# Altium project ESC_Board_Prj.PrjPcb (part 2 of 2)

## Sheet Non_Iso_Regulators.SchDoc
size A4; SheetNumber: 4; SheetTotal: 4
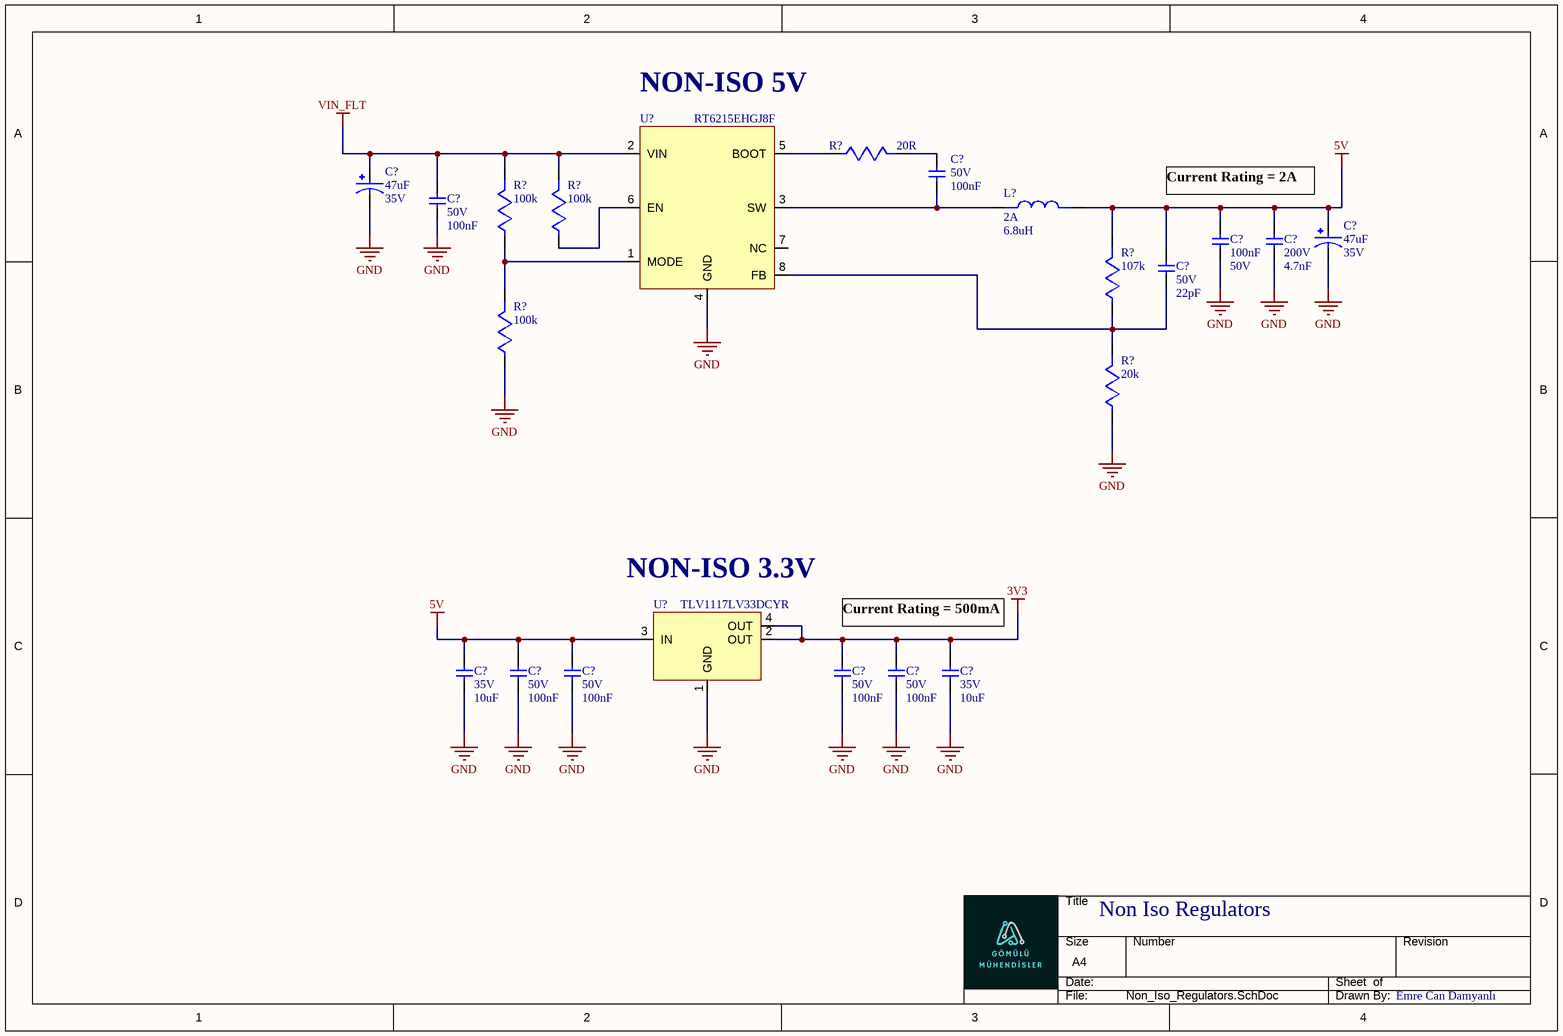
[diagram p3: Non_Iso_Regulators.SchDoc]

### Parts
(Parts that share a designator on the sheet are numbered #1, #2 ... from top to bottom, then left to right.)
C?#19  value 100nF  Voltage Rating: 50V  [CAPC1608X94N]  (hidden comment: C0603C104K5RACTU)
C?#20  value 47uF  Voltage Ratings: 35V  [CAPMP7343X310N]  (hidden comment: T495X476M035ATE300)
C?#21  value 100nF  Voltage Rating: 50V  [CAPC1608X94N]  (hidden comment: C0603C104K5RACTU)
C?#22  value 100nF  Voltage: 50V  [CAPC3216X160N]  (hidden comment: KAM31NR81H104KU)
C?#23  value 4.7nF  Voltage Rating: 200V  (hidden comment: C1206C472J2GECAUTO)
C?#24  value 47uF  Voltage Ratings: 35V  [CAPMP7343X310N]  (hidden comment: T495X476M035ATE300)
C?#25  value 22pF  Voltage Rating (DC): 50V  [CAPC1608X94N]  (hidden comment: C0603C220J5GACTU)
C?#26  value 10uF  Voltage Rating: 35V  [CAPC2012X145N]  (hidden comment: C2012X5R1V106K125AC)
C?#27  value 100nF  Voltage Rating: 50V  [CAPC1608X94N]  (hidden comment: C0603C104K5RACTU)
C?#28  value 100nF  Voltage Rating: 50V  [CAPC1608X94N]  (hidden comment: C0603C104K5RACTU)
C?#29  value 100nF  Voltage Rating: 50V  [CAPC1608X94N]  (hidden comment: C0603C104K5RACTU)
C?#30  value 100nF  Voltage Rating: 50V  [CAPC1608X94N]  (hidden comment: C0603C104K5RACTU)
C?#31  value 10uF  Voltage Rating: 35V  [CAPC2012X145N]  (hidden comment: C2012X5R1V106K125AC)
L?  value 6.8uH  Current Rating: 2A  [INDPM5752X200N]  (hidden comment: 74437334068)
R?#13  value 20R  (hidden comment: RC0603FR-0720RL)
R?#14  value 100k  [RESISTOR_0603]  (hidden comment: RC0603FR-07100KL)
R?#15  value 100k  [RESISTOR_0603]  (hidden comment: RC0603FR-07100KL)
R?#16  value 107k  [RESISTOR_0603]  (hidden comment: RC0603FR-07107KL)
R?#17  value 100k  [RESISTOR_0603]  (hidden comment: RC0603FR-07100KL)
R?#18  value 20k  [RESISTOR_0603]  (hidden comment: RC0603FR-0720KL)
U?#2  RT6215EHGJ8F  [IC_LTC2960HTS8-1#TRMPBF]
U?#3  TLV1117LV33DCYR  [VREG_TLV1117LV33DCYR]

### Nets
3V3: C?#29.2 C?#30.2 C?#31.2 U?#3.2(OUT) U?#3.4(OUT)
5V: C?#22.1 C?#23.2 C?#24.1 C?#25.2 C?#26.2 C?#27.2 C?#28.2 L?.2 R?#16.2 U?#3.3(IN)
GND: C?#20.2 C?#21.1 C?#22.2 C?#23.1 C?#24.2 C?#26.1 C?#27.1 C?#28.1 C?#29.1 C?#30.1 C?#31.1 R?#17.1 R?#18.1 U?#2.4(GND) U?#3.1(GND)
VIN_FLT: C?#20.1 C?#21.2 R?#14.2 R?#15.2 U?#2.2(VIN)
NetC?#19_1: C?#19.1 L?.1 U?#2.3(SW)
NetC?#19_2: C?#19.2 R?#13.2
NetC?#25_1: C?#25.1 R?#16.1 R?#18.2 U?#2.8(FB)
NetR?#13_1: R?#13.1 U?#2.5(BOOT)
NetR?#14_1: R?#14.1 R?#17.2 U?#2.1(MODE)
NetR?#15_1: R?#15.1 U?#2.6(EN)

Not connected (* = marked no-connect by the designer): U?#2 7(NC)

### Notes on the sheet
- NON-ISO 5V
- (near C?#23) Current Rating = 2A
- (near U?#3) NON-ISO 3.3V
- (near C?#30) Current Rating = 500mA
- Non Iso Regulators
- Emre Can Damyanlı

### Library data of the parts
C?#19 C?#21 C?#27-C?#30 = C0603C104K5RACTU: Multilayer Ceramic Capacitor, 0.1 uF, 50 V, ± 10%, X7R, 0603 [1608 Metric]; Manufacturer: KEMET; Material: 4241ConductorMaterial; Temperature Coefficient: 30ppm/°C; Supplier: Digi-Key; Supplier Part Number: 399-C0603C104K5RAC7867CT-ND; Manufacturer Part Number: C0603C104K5RACTU; RoHS: Yes; Category: Ceramic Capacitors; Stock: 6050842; Pricing: 1=0,1, 10=0,07, 50=0,0404, 100=0,0312, 500=0,02352, 1000=0,01848 (USD); Mounting Technology: Surface Mount; Case/Package: 0603; Min Operating Temperature: -55°C; Max Operating Temperature: 125°C; Tolerance: 10%; Dielectric: X7R; Packaging: Tape and Reel; Voltage: 50V; Series: SMD Comm X7R; Length: 0.063inch; Width: 0.031inch; Thickness: 0.034inch; RoHS Compliant: Yes; Lead Free: 5697LeadFree
C?#20 C?#24 = T495X476M035ATE300: Cap Tant Solid 47uF 35V X CASE 20% (7.3 X 4.3 X 4mm) SMD 7343-43 0.3 Ohm 125 C T/R; Manufacturer: KEMET; Supplier: Digi-Key; Supplier Part Number: 399-10312-1-ND; Manufacturer Part Number: T495X476M035ATE300; RoHS: Yes; Category: Tantalum Capacitors; Stock: 2749; Pricing: 1=2,12, 10=1,711, 50=1,4932, 100=1,3065 (USD); ComponentLink1URL: https://datasheet.ciiva.com/46437/1761160-46437884.pdf?src-supplier=Element14; ComponentLink1Description: https://datasheet.ciiva.com/46437/1761160-46437884.pdf?src-supplier=Element14; ComponentLink2URL: https://datasheet.ciiva.com/5933/kem-t2009-t495-5933557.pdf?src-supplier=Farnell; ComponentLink2Description: https://datasheet.ciiva.com/5933/kem-t2009-t495-5933557.pdf?src-supplier=Farnell; ComponentLink3URL: https://datasheet.ciiva.com/7759/kem-t2009-t495-7759181.pdf?src-supplier=Element14; ComponentLink3Description: https://datasheet.ciiva.com/7759/kem-t2009-t495-7759181.pdf?src-supplier=Element14
C?#22 = KAM31NR81H104KU: 0.1 µF ±10% 50V Ceramic Capacitor X8R 1206 (3216 Metric); Manufacturer: Kyocera AVX; Supplier: Digi-Key; Supplier Part Number: 478-KAM31NR81H104KUCT-ND; Manufacturer Part Number: KAM31NR81H104KU; RoHS: No; Stock: 245787; Pricing: 1=0,25, 10=0,173, 50=0,1152, 100=0,0979, 500=0,06912, 1000=0,06048 (USD)
C?#23 = C1206C472J2GECAUTO: Cap Cer 1206 4.7NF 200V C0G 5%; Manufacturer: KEMET; Supplier: Digi-Key; Supplier Part Number: 399-C1206C472J2GECAUTOCT-ND; Manufacturer Part Number: C1206C472J2GECAUTO; RoHS: Yes; Category: Ceramic Capacitors; Stock: 3910; Pricing: 1=0,43, 10=0,285, 50=0,21, 100=0,171, 500=0,135, 1000=0,114 (USD); Mounting Technology: Surface Mount; Case/Package: 1206; Min Operating Temperature: -55°C; Max Operating Temperature: 125°C; Series: ESD SMD Auto C0G; Packaging: Tape and Reel; Tolerance: 5%; Ratings: AEC-Q200; RoHS Compliant: Yes; ComponentLink1URL: https://api.kemet.com/component-edge/download/datasheet/C1206C472J2GECAUTO.pdf?src-supplier=Digi-Key; ComponentLink1Description: https://api.kemet.com/component-edge/download/datasheet/C1206C472J2GECAUTO.pdf?src-supplier=Digi-Key
C?#25 = C0603C220J5GACTU: Multilayer Ceramic Capacitor, 22 pF, 50 V, ± 5%, C0G (NP0), 0603 [1608 Metric]; Manufacturer: KEMET; Material: 4241ConductorMaterial; Supplier: Digi-Key; Supplier Part Number: 399-C0603C220J5GAC7867CT-ND; Manufacturer Part Number: C0603C220J5GACTU; RoHS: Yes; Category: Ceramic Capacitors; Stock: 138104; Pricing: 1=0,13, 10=0,087, 50=0,052, 100=0,0408, 500=0,03016, 1000=0,02497 (USD); Mounting Technology: Surface Mount,PCB; Case/Package: 0603; Case Code (Metric): 1608; Case Code (Imperial): 0603; Weight: 7.1E-05oz; Min Operating Temperature: -55°C; Max Operating Temperature: 125°C; Tolerance: 5%; Dielectric: C0G; Packaging: Tape and Reel; Termination: SMD/SMT; Voltage: 50V; Series: SMD Comm C0G; Voltage Rating: 50V; Construction: Flat; Length: 1.6mm; Width: 0.8mm; Height: 0.8mm; Depth: 0.8mm; Radiation Hardening: No; RoHS Compliant: Yes; Lead Free: 5697LeadFree; ComponentLink1URL: https://datasheet.ciiva.com/7824/f9080b-0402-series-c0g-7824012.pdf?src-supplier=Element14; ComponentLink1Description: https://datasheet.ciiva.com/7824/f9080b-0402-series-c0g-7824012.pdf?src-supplier=Element14; ComponentLink2URL: https://datasheet.ciiva.com/14586/70095383-14586058.pdf?src-supplier=Allied+Electronics; ComponentLink2Description: https://datasheet.ciiva.com/14586/70095383-14586058.pdf?src-supplier=Allied+Electronics; ComponentLink3URL: https://datasheet.ciiva.com/14599/70095383-14599853.pdf?src-supplier=Allied+Electronics; ComponentLink3Description: https://datasheet.ciiva.com/14599/70095383-14599853.pdf?src-supplier=Allied+Electronics; ComponentLink4URL: https://datasheet.ciiva.com/18192/getdatasheetpartid-385505-18192854.pdf?src-supplier=Verical; ComponentLink4Description: https://datasheet.ciiva.com/18192/getdatasheetpartid-385505-18192854.pdf?src-supplier=Verical
C?#26 C?#31 = C2012X5R1V106K125AC: Cap Ceramic 10uF 35V X5R 10% SMD 0805 85°C Blister Plastic T/R; Manufacturer: TDK; Supplier: Digi-Key; Supplier Part Number: 445-14418-1-ND; Manufacturer Part Number: C2012X5R1V106K125AC; RoHS: Yes; Category: Ceramic Capacitors; Stock: 387097; Pricing: 1=0,63, 10=0,42, 50=0,3342, 100=0,276, 500=0,2156, 1000=0,18326 (USD); Mounting Technology: Surface Mount; Case/Package: 0805; Case Code (Metric): 2012; Case Code (Imperial): 0805; Weight: 0.000194oz; Dielectric Material: Ceramic; Min Operating Temperature: -55°C; Max Operating Temperature: 85°C; Package Quantity: 2000; Packaging: Tape and Reel; Tolerance: 10%; Dielectric: X5R; Termination: SMD/SMT; Voltage Rating (DC): 35V; Series: C; Length: 2mm; Width: 1.25mm; Height: 1.25mm; Reach SVHC Compliant: No; Lead Free: Lead Free; RoHS Compliant: Yes; ComponentLink1URL: https://datasheet.ciiva.com/14886/tdkmlcccaprange-14886603.pdf?src-supplier=Digi-Key; ComponentLink1Description: https://datasheet.ciiva.com/14886/tdkmlcccaprange-14886603.pdf?src-supplier=Digi-Key; ComponentLink2URL: https://datasheet.ciiva.com/14886/tdkmlcccaprange-14886602.pdf?src-supplier=Digi-Key; ComponentLink2Description: https://datasheet.ciiva.com/14886/tdkmlcccaprange-14886602.pdf?src-supplier=Digi-Key; ComponentLink3URL: https://datasheet.ciiva.com/14886/tdkmlcccaprange-14886604.pdf?src-supplier=Digi-Key; ComponentLink3Description: https://datasheet.ciiva.com/14886/tdkmlcccaprange-14886604.pdf?src-supplier=Digi-Key
L? = 74437334068: Fixed Ind 6.8UH 2A 150 Mohm SMD; Manufacturer: Wurth Electronics; Core Material: Ferrite; Saturation Current: 4.6A; Shielding: Shielded; DC Resistance (DCR): 150mR; Self Resonant Frequency: 20.5MHz; Test Frequency: 100kHz; Tolerance: 20%; Supplier: Digi-Key; Supplier Part Number: 732-6156-1-ND; Manufacturer Part Number: 74437334068; RoHS: Yes; Category: Fixed Inductors; Stock: 3097; Pricing: 1=2,55, 50=2,36, 100=2,145, 250=1,951, 500=1,773 (USD); Mounting Technology: Surface Mount; Case/Package: 5020; Pins: 2; Min Operating Temperature: -40°C; Max Operating Temperature: 125°C; Packaging: Tape and Reel; RMS Current (Irms): 2A; Inductance Tolerance: 20%; Termination: SMD/SMT; Max DC Current: 2A; Package Quantity: 3000; Series: WE-LHMI; Length: 0.205inch; Width: 5.2mm; Height: 1.8mm; Height - Seated (Max): 0.078inch; RoHS Compliant: Yes; Reach SVHC Compliant: Unknown; ComponentLink1URL: http://www.farnell.com/datasheets/1880901.pdf?src-supplier=Farnell; ComponentLink1Description: http://www.farnell.com/datasheets/1880901.pdf?src-supplier=Farnell; ComponentLink2URL: http://www.mouser.com/ds/2/445/74437334068-516434.pdf?src-supplier=Mouser; ComponentLink2Description: http://www.mouser.com/ds/2/445/74437334068-516434.pdf?src-supplier=Mouser; ComponentLink3URL: http://www.farnell.com/datasheets/1880901.pdf?src-supplier=Element14; ComponentLink3Description: http://www.farnell.com/datasheets/1880901.pdf?src-supplier=Element14; ComponentLink4URL: https://datasheet.octopart.com/74437334068-W%C3%BCrth-Elektronik-datasheet-37143636.pdf?src-supplier=Newark; ComponentLink4Description: https://datasheet.octopart.com/74437334068-W%C3%BCrth-Elektronik-datasheet-37143636.pdf?src-supplier=Newark; ComponentLink5URL: https://katalog.we-online.de/pbs/datasheet/74437334068.pdf?src-supplier=Digi-Key; ComponentLink5Description: https://katalog.we-online.de/pbs/datasheet/74437334068.pdf?src-supplier=Digi-Key
R?#13 = RC0603FR-0720RL: SMD Chip Resistor, 20 Ohm, ± 1%, 100 mW, 0603 [1608 Metric], Thick Film, General Purpose; Manufacturer: Yageo; Power Rating: 100mW; Voltage Rating: 50V; Temperature Coefficient: 100ppm/°C; Working Voltage: 75V; Supplier: Digi-Key; Supplier Part Number: 311-20.0HRCT-ND; Manufacturer Part Number: RC0603FR-0720RL; RoHS: Yes; Category: Chip SMD Resistors; Stock: 293682; Pricing: 1=0,1, 10=0,018, 50=0,0106, 100=0,0088, 500=0,00592, 1000=0,00505 (USD); Case/Package: 0603; Case Code (Imperial): 0603; Case Code (Metric): 1608; Min Operating Temperature: -55°C; Max Operating Temperature: 155°C; Tolerance: 1%; Packaging: Tape and Reel; Package Quantity: 5000; Termination: SMD/SMT; Resistor Type: Thick Film; Number of Terminations: 2; Max Power Dissipation: 100mW; Voltage Rating (DC): 50V; Features: Moisture Resistant; Series: RC; Construction: Rectangular; Technology: THICK FILM; Resistance Tolerance: 1%; Length: 1.6mm; Width: 0.031inch; Height: 0.45mm; Depth: 0.8mm; Reach SVHC Compliant: No; Military Standard: Not; Lead Free: Lead Free; RoHS Compliant: Yes; ComponentLink1URL: https://datasheet.ciiva.com/11819/0900766b80f96399-11819290.pdf?src-supplier=Rs; ComponentLink1Description: https://datasheet.ciiva.com/11819/0900766b80f96399-11819290.pdf?src-supplier=Rs; ComponentLink2URL: https://datasheet.ciiva.com/46395/443971-46395031.pdf?src-supplier=Element14; ComponentLink2Description: https://datasheet.ciiva.com/46395/443971-46395031.pdf?src-supplier=Element14; ComponentLink3URL: https://datasheet.ciiva.com/2454/pyu-r-int-thick-7-2454028.pdf?src-supplier=Digi-Key; ComponentLink3Description: https://datasheet.ciiva.com/2454/pyu-r-int-thick-7-2454028.pdf?src-supplier=Digi-Key; ComponentLink4URL: https://datasheet.ciiva.com/2454/pyu-r-int-thick-7-2454029.pdf?src-supplier=Digi-Key; ComponentLink4Description: https://datasheet.ciiva.com/2454/pyu-r-int-thick-7-2454029.pdf?src-supplier=Digi-Key; ComponentLink5URL: https://datasheet.ciiva.com/2454/pyu-r-int-thick-7-2454027.pdf?src-supplier=Digi-Key; ComponentLink5Description: https://datasheet.ciiva.com/2454/pyu-r-int-thick-7-2454027.pdf?src-supplier=Digi-Key; ComponentLink6URL: https://datasheet.ciiva.com/12557/rc0603-272842-12557941.pdf?src-supplier=Mouser; ComponentLink6Description: https://datasheet.ciiva.com/12557/rc0603-272842-12557941.pdf?src-supplier=Mouser; ComponentLink7URL: https://datasheet.ciiva.com/15189/getdatasheetpartid-324013-15189653.pdf?src-supplier=Verical; ComponentLink7Description: https://datasheet.ciiva.com/15189/getdatasheetpartid-324013-15189653.pdf?src-supplier=Verical
R?#14 R?#15 R?#17 = RC0603FR-07100KL: SMD Chip Resistor, 100 kOhm, ± 1%, 100 mW, 0603 [1608 Metric], Thick Film, General Purpose; Manufacturer: Yageo; Temperature Coefficient: 100ppm/°C; Voltage Rating (DC): 50V; Power Rating: 100mW; Supplier: Digi-Key; Supplier Part Number: 311-100KHRCT-ND; Manufacturer Part Number: RC0603FR-07100KL; RoHS: Yes; Category: Chip SMD Resistors; Stock: 3229176; Pricing: 1=0,1, 10=0,018, 50=0,0106, 100=0,0088, 500=0,00592, 1000=0,00505 (USD); Case/Package: 0603; Pins: 2; Case Code (Imperial): 0603; Case Code (Metric): 1608; Min Operating Temperature: -55°C; Max Operating Temperature: 155°C; Tolerance: 1%; Resistor Type: Thick Film; Packaging: Tape and Reel; Voltage Rating: 50V; Termination: SMD/SMT; Number of Terminations: 2; Features: Moisture Resistant; Series: RC; Max Power Dissipation: 100mW; Resistance Tolerance: 1%; Construction: Rectangular; Technology: THICK FILM; Length: 1.6mm; Width: 0.8mm; Height: 0.45mm; Depth: 0.8mm; Reach SVHC Compliant: No; Military Standard: Not; RoHS Compliant: Yes
R?#16 = RC0603FR-07107KL: SMD Chip Resistor, 107 kOhm, ± 1%, 100 mW, 0603 [1608 Metric], Thick Film, General Purpose; Manufacturer: Yageo; Supplier: Digi-Key; Supplier Part Number: 311-107KHRCT-ND; Manufacturer Part Number: RC0603FR-07107KL; RoHS: Yes; Category: Chip SMD Resistors; Stock: 55052; Pricing: 1=0,1, 10=0,018, 50=0,0106, 100=0,0088, 500=0,00592, 1000=0,00505 (USD); Lead Free: 5697LeadFree; ComponentLink1URL: http://www.mouser.com/ds/2/447/RC0603-272842.pdf?src-supplier=Mouser; ComponentLink1Description: http://www.mouser.com/ds/2/447/RC0603-272842.pdf?src-supplier=Mouser; ComponentLink2URL: http://www.yageo.com/documents/recent/PYu-RC_Group_51_RoHS_L_9.pdf?src-supplier=Digi-Key; ComponentLink2Description: http://www.yageo.com/documents/recent/PYu-RC_Group_51_RoHS_L_9.pdf?src-supplier=Digi-Key; ComponentLink3URL: https://datasheet.octopart.com/RC0603FR-07107KL-Yageo-datasheet-118562.pdf?src-supplier=Digi-Key; ComponentLink3Description: https://datasheet.octopart.com/RC0603FR-07107KL-Yageo-datasheet-118562.pdf?src-supplier=Digi-Key; ComponentLink4URL: https://datasheet.octopart.com/RC0603FR-07107KL-Yageo-datasheet-164759695.pdf?src-supplier=Future+Electronics; ComponentLink4Description: https://datasheet.octopart.com/RC0603FR-07107KL-Yageo-datasheet-164759695.pdf?src-supplier=Future+Electronics
R?#18 = RC0603FR-0720KL: SMD Chip Resistor, 20 kOhm, ± 1%, 100 mW, 0603 [1608 Metric], Thick Film, General Purpose; Manufacturer: Yageo; Temperature Coefficient: 100ppm/°C; Voltage Rating (DC): 50V; Power Rating: 100mW; Supplier: Digi-Key; Supplier Part Number: 311-20.0KHRCT-ND; Manufacturer Part Number: RC0603FR-0720KL; RoHS: Yes; Category: Chip SMD Resistors; Stock: 6106196; Pricing: 1=0,1, 10=0,018, 50=0,0106, 100=0,0088, 500=0,00592, 1000=0,00505 (USD); Case/Package: 0603; Pins: 2NUMBER; Case Code (Imperial): 0603; Case Code (Metric): 1608; Min Operating Temperature: -55°C; Max Operating Temperature: 155°C; Tolerance: 1%; Packaging: Tape and Reel; Resistor Type: Thick Film; Voltage Rating: 50V; Package Quantity: 1; Termination: SMD/SMT; Number of Terminations: 2; Max Power Dissipation: 100mW; Features: Moisture Resistant; Series: RC; Technology: THICK FILM; Construction: Rectangular; Resistance Tolerance: 1%; Length: 0.063inch; Width: 0.031inch; Height: 0.022inch; Depth: 0.8mm; RoHS Compliant: Yes; Lead Free: 5697LeadFree; Reach SVHC Compliant: No; Military Standard: Not; ComponentLink1URL: https://datasheet.ciiva.com/11808/0900766b80f96399-11808275.pdf?src-supplier=Rs; ComponentLink1Description: https://datasheet.ciiva.com/11808/0900766b80f96399-11808275.pdf?src-supplier=Rs; ComponentLink2URL: https://datasheet.ciiva.com/22747/443971-22747525.pdf?src-supplier=Element14; ComponentLink2Description: https://datasheet.ciiva.com/22747/443971-22747525.pdf?src-supplier=Element14; ComponentLink3URL: https://datasheet.ciiva.com/2453/pyu-r-int-thick-7-2453911.pdf?src-supplier=Digi-Key; ComponentLink3Description: https://datasheet.ciiva.com/2453/pyu-r-int-thick-7-2453911.pdf?src-supplier=Digi-Key; ComponentLink4URL: https://datasheet.ciiva.com/2453/pyu-r-int-thick-7-2453912.pdf?src-supplier=Digi-Key; ComponentLink4Description: https://datasheet.ciiva.com/2453/pyu-r-int-thick-7-2453912.pdf?src-supplier=Digi-Key; ComponentLink5URL: https://datasheet.ciiva.com/2453/pyu-r-int-thick-7-2453910.pdf?src-supplier=Digi-Key; ComponentLink5Description: https://datasheet.ciiva.com/2453/pyu-r-int-thick-7-2453910.pdf?src-supplier=Digi-Key
U?#2 = RT6215EHGJ8F: Buck Switching Regulator IC Positive Adjustable 0.791V 1 Output 2A SOT-23-8 Thin, TSOT-23-8; Manufacturer: Richtek; Number of Outputs: 1; Min Input Voltage: 4.5V; Max Supply Voltage: 24V; Min Output Voltage: 791mV; Max Output Voltage: 5V; Switching Frequency: 500kHz; Synchronous Rectifier: Yes; Supplier: Digi-Key; Supplier Part Number: RT6215EHGJ8FCT-ND; Manufacturer Part Number: RT6215EHGJ8F; RoHS: No; Category: Voltage Regulators - Switching; Stock: 5469; Pricing: 1=0,99, 10=0,888, 25=0,8428, 100=0,6923, 250=0,64712, 500=0,57186, 1000=0,45147 (USD); Min Operating Temperature: -40°C; Max Operating Temperature: 85°C; Output Current: 2A; Output Type: Adjustable; Output Configuration: Positive; Series: ACOT™; RoHS Compliant: Yes; ComponentLink1URL: http://www.farnell.com/datasheets/2259293.pdf?src-supplier=Farnell; ComponentLink1Description: http://www.farnell.com/datasheets/2259293.pdf?src-supplier=Farnell; ComponentLink2URL: http://www.farnell.com/datasheets/2259293.pdf?src-supplier=Newark; ComponentLink2Description: http://www.farnell.com/datasheets/2259293.pdf?src-supplier=Newark; ComponentLink3URL: http://www.richtek.com/assets/product_file/RT6215E/DS6215E-00.pdf?src-supplier=Digi-Key; ComponentLink3Description: http://www.richtek.com/assets/product_file/RT6215E/DS6215E-00.pdf?src-supplier=Digi-Key; ComponentLink4URL: https://www.richtek.com/assets/product_file/RT6215E/DS6215E-00.pdf?src-supplier=Digi-Key; ComponentLink4Description: https://www.richtek.com/assets/product_file/RT6215E/DS6215E-00.pdf?src-supplier=Digi-Key
U?#3 = TLV1117LV33DCYR: IC REG LDO 3.3V 1A SOT223; Manufacturer: Texas Instruments; Supplier: Digi-Key; Supplier Part Number: 296-28778-1-ND; Manufacturer Part Number: TLV1117LV33DCYR; RoHS: Yes; Category: Voltage Regulators - Linear; Stock: 34293; Pricing: 1=0,35, 10=0,285, 25=0,2604, 100=0,1939, 250=0,17576, 500=0,14544, 1000=0,10908 (USD); ComponentLink1URL: https://datasheet.ciiva.com/2060/tlv1117lv-2060227.pdf?src-supplier=Digi-Key; ComponentLink1Description: https://datasheet.ciiva.com/2060/tlv1117lv-2060227.pdf?src-supplier=Digi-Key; ComponentLink2URL: https://datasheet.ciiva.com/2060/tlv1117lv-2060228.pdf?src-supplier=Digi-Key; ComponentLink2Description: https://datasheet.ciiva.com/2060/tlv1117lv-2060228.pdf?src-supplier=Digi-Key; ComponentLink3URL: https://datasheet.ciiva.com/2060/tlv1117lv-2060226.pdf?src-supplier=Digi-Key; ComponentLink3Description: https://datasheet.ciiva.com/2060/tlv1117lv-2060226.pdf?src-supplier=Digi-Key; ComponentLink4URL: https://datasheet.ciiva.com/46443/1857581-46443437.pdf?src-supplier=Element14; ComponentLink4Description: https://datasheet.ciiva.com/46443/1857581-46443437.pdf?src-supplier=Element14; ComponentLink5URL: https://datasheet.ciiva.com/46443/1857581-46443438.pdf?src-supplier=Element14; ComponentLink5Description: https://datasheet.ciiva.com/46443/1857581-46443438.pdf?src-supplier=Element14; ComponentLink6URL: https://datasheet.ciiva.com/46443/1857581-46443450.pdf?src-supplier=Element14; ComponentLink6Description: https://datasheet.ciiva.com/46443/1857581-46443450.pdf?src-supplier=Element14

## Sheet Iso_Regulators.SchDoc
size A4; SheetNumber: 5; SheetTotal: 5
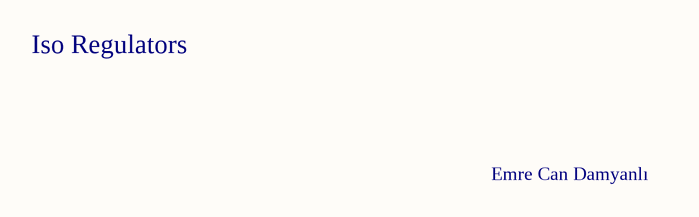
[diagram p4: Iso_Regulators.SchDoc]

### Notes on the sheet
- Iso Regulators
- Emre Can Damyanlı

## Nets that join several sheets
CHS: Power_In (6 pins), Filter (C?#10.1 C?#17.1 C?#18.1)
GND: Filter (9 pins), Non_Iso_Regulators (15 pins)
GND_IN: Power_In (12 pins), Filter (5 pins)
VCC: Power_In (C?#4.1 R?#1.2 R?#6.2 U?#1.2), Filter (5 pins)
VIN_FLT: Filter (8 pins), Non_Iso_Regulators (5 pins)

## Assembly variants
DNP: not fitted C? C? C? R?